# EAGLE design MASTER CEAQL PCB (EAGLE 9.2.0)
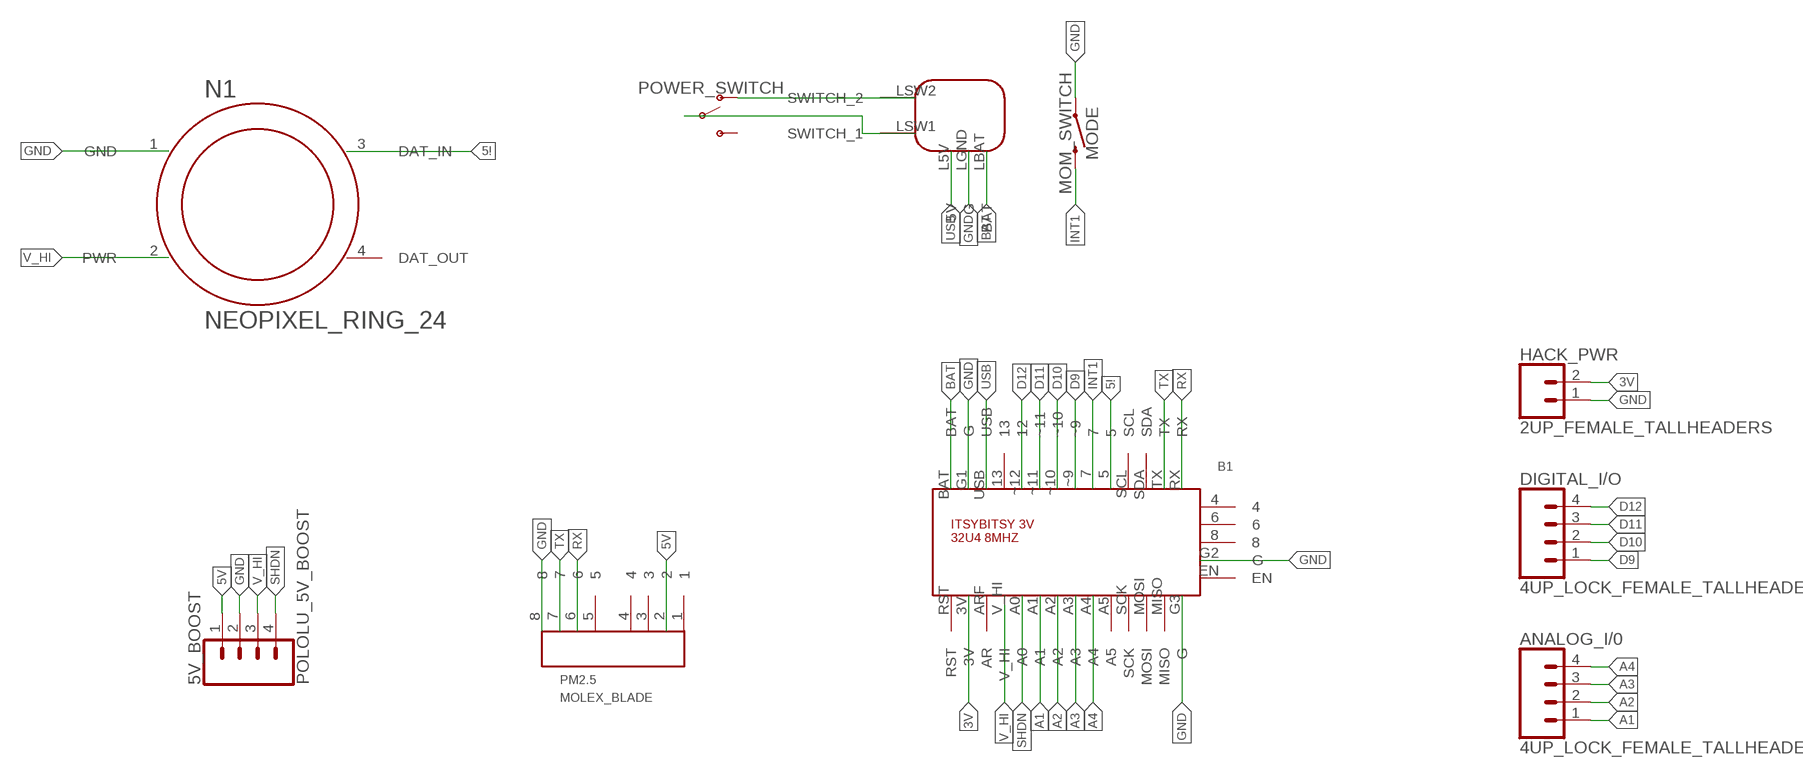
[diagram p0: schematic, sheet 1]

## Parts
5V_BOOST  POLOLU_5V_BOOST  [POLOLU_5V_HEADERS]
ANALOG_I/0  4UP_LOCK_FEMALE_TALLHEADERS  [1X04_LOCK_TALL]
B1  ITSY_BITSY  [ITSY_BITSY]
DIGITAL_I/O  4UP_LOCK_FEMALE_TALLHEADERS  [1X04_LOCK_TALL]
HACK_PWR  2UP_FEMALE_TALLHEADERS  [1X02]
L1  LIPOLY_CHARGER  [LIPOLY_CHARGER]
MODE  MOM_SWITCH  MOM_SWITCH_B3F-1000  [TACTILE_SWITCH_PTH_6.0MM]
N1  NEOPIXEL_RING_24  [NEOPIXEL_RNG_24]
PM2.5  MOLEX_BLADE  [53047-08]
POWER_SWITCH  SWITCH_SPDT_PINMOUNT  [SWITCH_SPDT_PTH_11.6X4.0MM_LOCK]

## Nets
3V: B1.3V HACK_PWR.2
5!: B1.5 N1.3(DAT_IN)
5V: 5V_BOOST.1 PM2.5.2
A1: ANALOG_I/0.1 B1.A1
A2: ANALOG_I/0.2 B1.A2
A3: ANALOG_I/0.3 B1.A3
A4: ANALOG_I/0.4 B1.A4
BAT: B1.BAT L1.LBAT(BAT)
D9: B1.~9 DIGITAL_I/O.1
D10: B1.~10 DIGITAL_I/O.2
D11: B1.~11 DIGITAL_I/O.3
D12: B1.~12 DIGITAL_I/O.4
GND: 5V_BOOST.2 B1.G1(G) B1.G2(G) B1.G3(G) HACK_PWR.1 L1.LGND(G) MODE.1 N1.1(GND) PM2.5.8
INT1: B1.7 MODE.2
N$5: L1.LSW2(SWITCH_2) POWER_SWITCH.1(O)
N$6: L1.LSW1(SWITCH_1) POWER_SWITCH.2(P)
RX: B1.RX PM2.5.6
SHDN: 5V_BOOST.4 B1.A0
TX: B1.TX PM2.5.7
USB: B1.USB L1.L5V(5V)
V_HI: 5V_BOOST.3 B1.V_HI N1.2(PWR)
Unconnected: B1.4 B1.6 B1.8 B1.13 B1.A5 B1.ARF(AR) B1.EN B1.MISO B1.MOSI B1.RST B1.SCK B1.SCL B1.SDA N1.4(DAT_OUT) PM2.5.1 PM2.5.3 PM2.5.4 PM2.5.5 POWER_SWITCH.3(S)

## Library data of the parts
5V_BOOST = TaylorSharpe Library:POLOLU_5V_BOOST: Pololu 5V Boost Board Low-profile headers (4-up) with board outline on footprint
ANALOG_I/0 DIGITAL_I/O = TaylorSharpe Library:4UP_LOCK_FEMALE_TALLHEADERS: 4-up locking connector to accommodate female header
B1 = TaylorSharpe Library:ITSY_BITSY: Adafruit ItsyBitsy 32u4 8MHz
HACK_PWR = TaylorSharpe Library:2UP_FEMALE_TALLHEADERS: 2-UP TALL FEMALE HEADERS 8.26mm black plastic headers
L1 = TaylorSharpe Library:LIPOLY_CHARGER
MODE = TaylorSharpe Library:MOM_SWITCH_B3F-1000: Adafruit Momentary Switch B3F-1000
N1 = TaylorSharpe Library:NEOPIXEL_RING_24: Neopixel Ring 24-Count Inverted - LEDs face down, away from board, on other side from through-holes
PM2.5 = TaylorSharpe Library:MOLEX_BLADE: Molex PicoBlade Header 1.25mm Pitch, 8-up
POWER_SWITCH = TaylorSharpe Library:SWITCH_SPDT_PINMOUNT: SPDT Switch Board-mounted, 2.54mm Pitch Mounted on the underside of the board, soldered on top

## Board
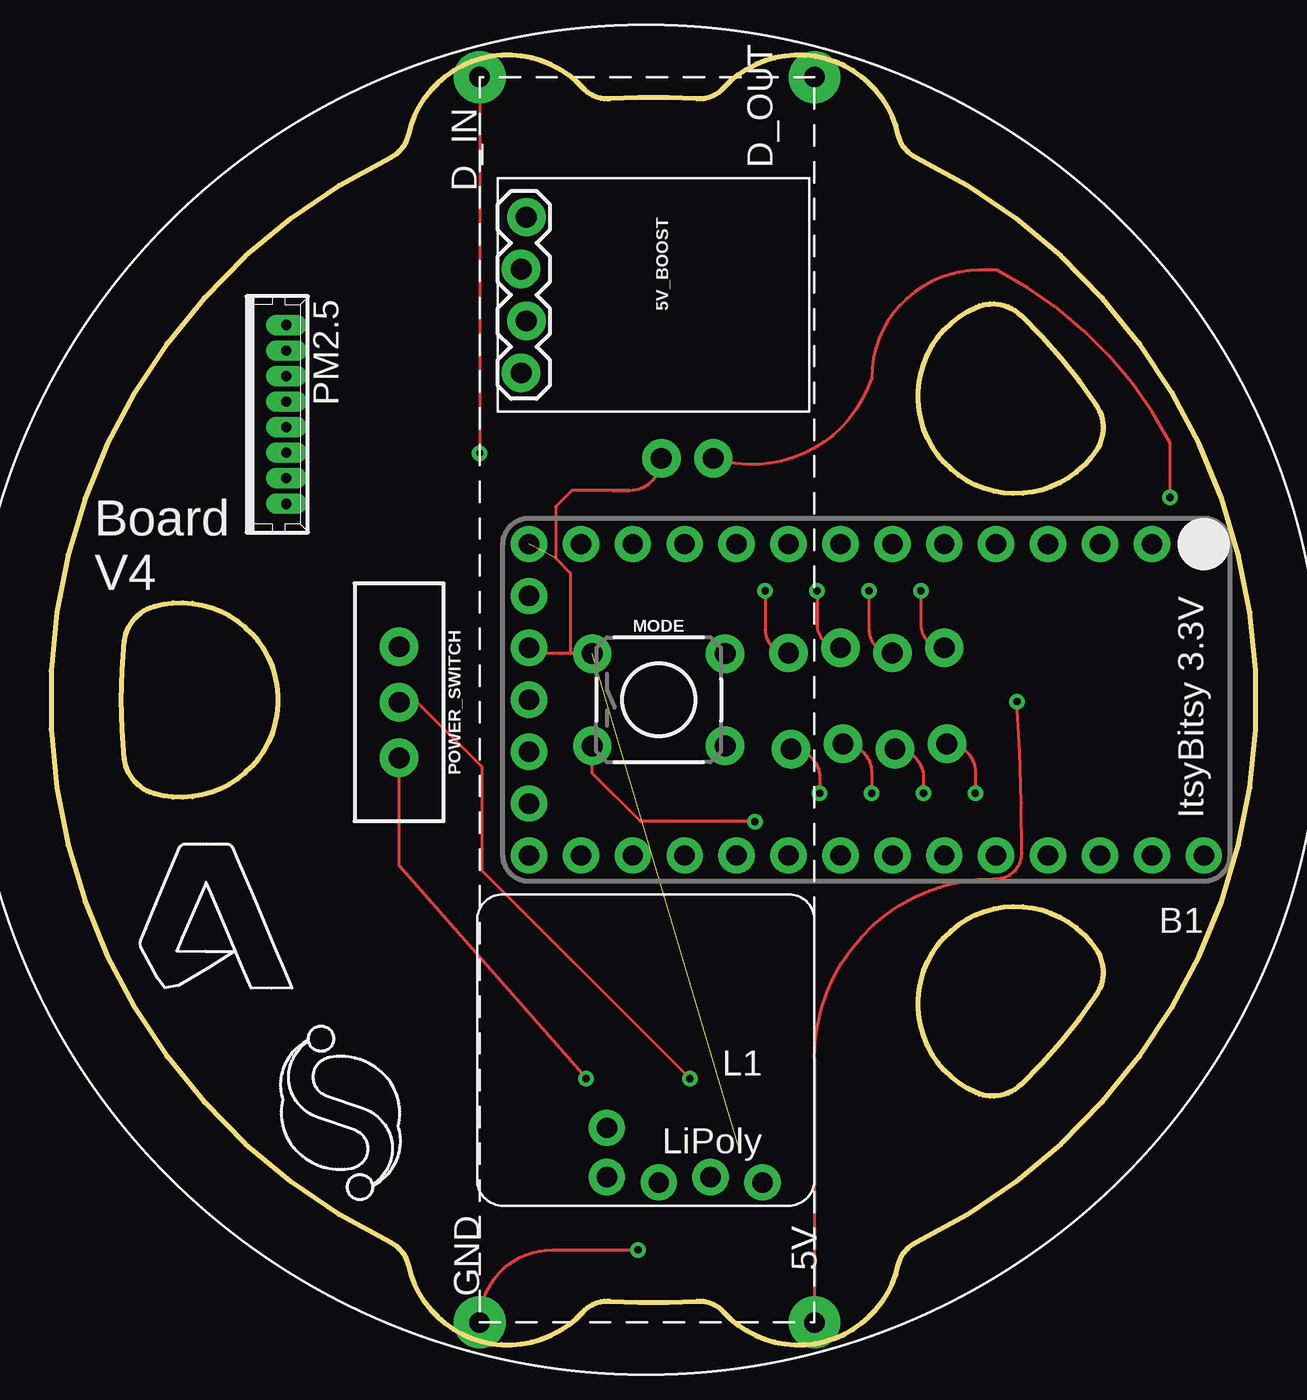
[diagram p1: board, top side]
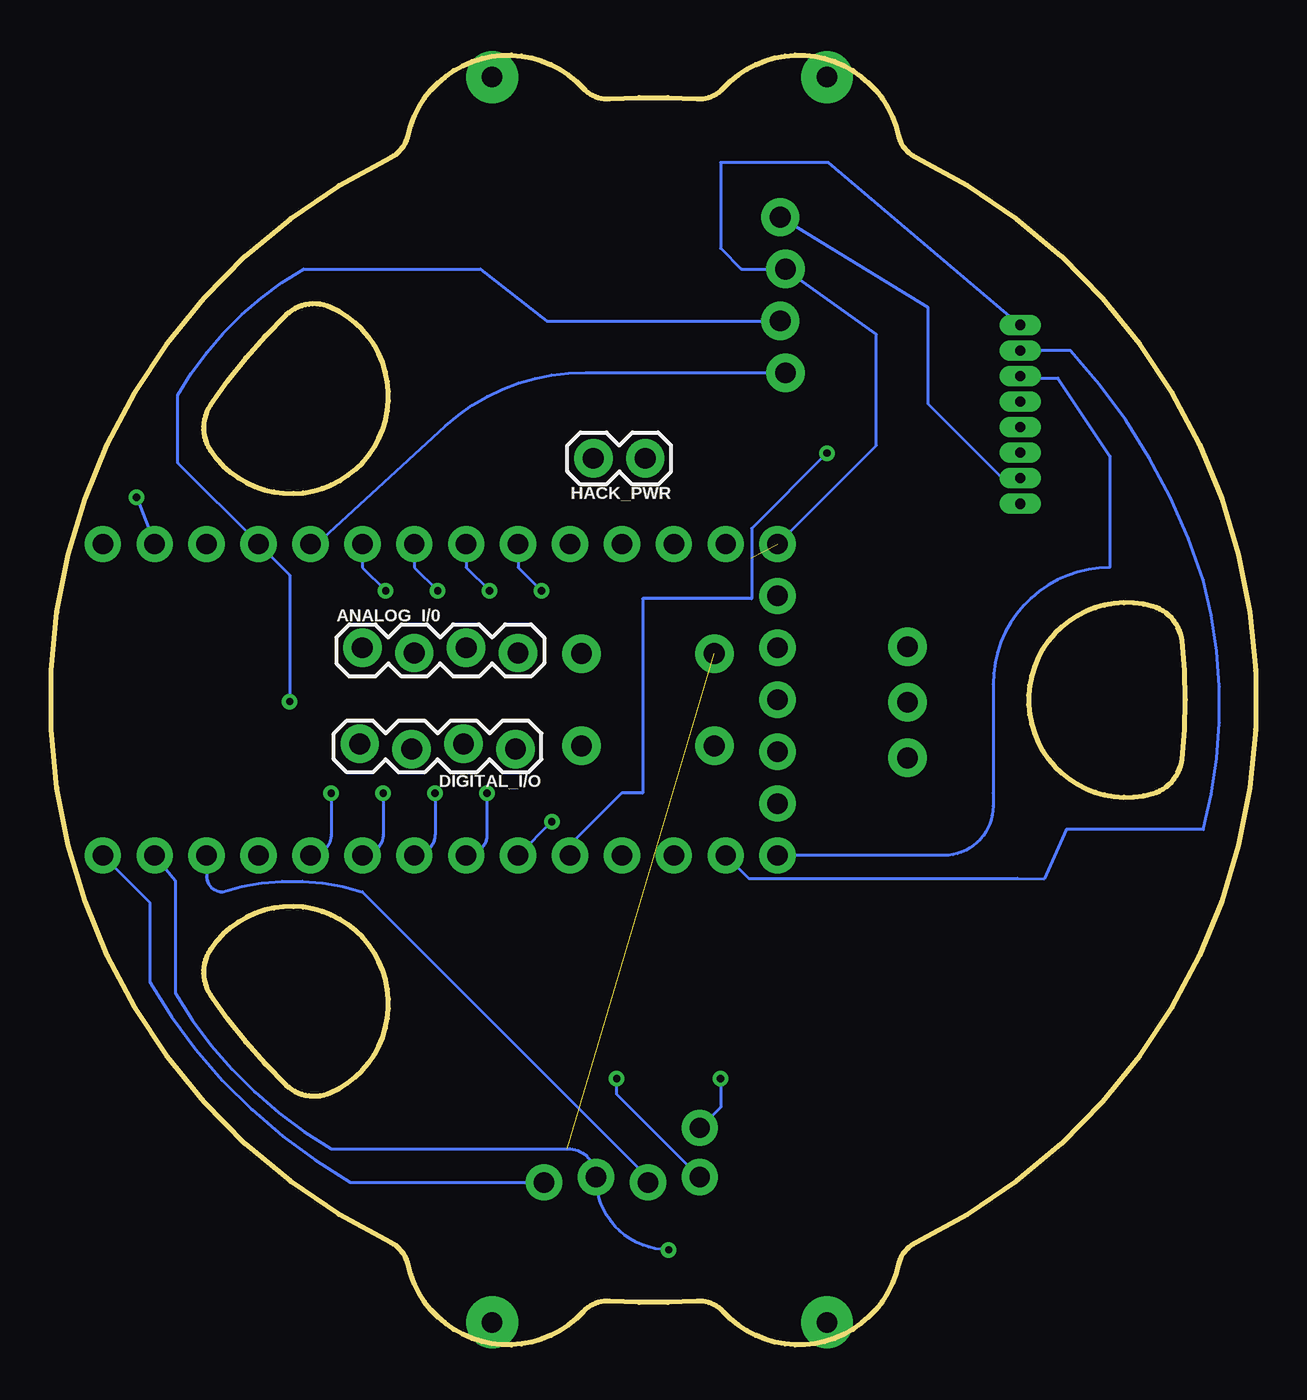
[diagram p2: board, bottom side, seen from below]

Size 58.93 x 63.12 mm. Coordinates in mm from the lower left corner, seen from the top.
Outline: 27.33,2.14 arc8 31.6,2.14 arc-52 32.89,1.62 arc125 41.46,3.92 arc-52 42.32,5.01 arc128 42.32,58.11 arc-52 41.46,59.2 arc125 32.89,61.5 arc-52 31.6,60.98 arc8 27.33,60.98 arc-52 26.04,61.5 arc125 17.47,59.2 arc-52 16.61,58.11 arc128 16.61,5.01 arc-52 17.47,3.92 arc125 26.04,1.62 arc-52 27.33,2.14
Outline: 51.13,19.36 arc-68 51.14,17.13 arc-13 47.44,12.72 arc-68 45.24,12.34 arc-212 51.13,19.36
Outline: 5.03,26.98 arc-68 3.59,28.68 arc-13 3.59,34.44 arc-68 5.03,36.14 arc-212 5.03,26.98
Outline: 45.24,50.78 arc-68 47.44,50.4 arc-13 51.14,45.99 arc-68 51.13,43.76 arc-212 45.24,50.78
Copper layers (1*16): Top 0.035mm / dielectric 1.5mm / Bottom 0.035mm
Design rules "default": minimum track width 6mil, minimum drill 0.35mm, track to track 6mil, track to pad 6mil, pad to pad 6mil, via to via 6mil, smd to smd 6mil, copper to edge 40mil, drill to drill 6mil, minimum pad ring 10mil, minimum via ring 8mil, stop-mask expansion 4mil, vias tented up to drill 0mil, thermal gap 10mil

### Footprints (pad centres in the part's own frame; a part is rotated, then mirrored left to right if it is on the bottom)
POLOLU_5V_HEADERS = drill 1.016 pad 1.88: 1 0,0.127; 2 2.54,-0.127; 3 5.08,0.127; 4 7.62,-0.127
1X04_LOCK_TALL = drill 1.016 pad 1.88: 1 0,0.127; 2 2.54,-0.127; 3 5.08,0.127; 4 7.62,-0.127
ITSY_BITSY = drill 1 pad 1.778: 3V 2.54,0; 4 33.02,12.7; 5 22.86,15.24; 6 33.02,10.16; 7 20.32,15.24; 8 33.02,7.62; 13 7.62,15.24; A0 10.16,0; A1 12.7,0; A2 15.24,0; A3 17.78,0; A4 20.32,0; A5 22.86,0; ARF 5.08,0; BAT 0,15.24; EN 33.02,2.54; G1 2.54,15.24; G2 33.02,5.08; G3 33.02,0; MISO 30.48,0; MOSI 27.94,0; RST 0,0; RX 33.02,15.24; SCK 25.4,0; SCL 25.4,15.24; SDA 27.94,15.24; TX 30.48,15.24; USB 5.08,15.24; V_HI 7.62,0; ~9 17.78,15.24; ~10 15.24,15.24; ~11 12.7,15.24; ~12 10.16,15.24
1X02 = drill 1.016 pad 1.88: 1 0,0; 2 2.54,0
LIPOLY_CHARGER = drill 1 pad 1.778: L5V 5.08,0.127; LBAT 0,0.127; LGND 2.54,-0.127; LSW1 7.62,-0.127; LSW2 7.62,-2.54
TACTILE_SWITCH_PTH_6.0MM = drill 1.016 pad 1.88: 1 -3.251,2.261; 2 -3.251,-2.261; 3 3.251,2.261; 4 3.251,-2.261
NEOPIXEL_RNG_24 = drill 1 pad 2.54: 1 0,0; 2 0,-16.383; 3 60.96,0; 4 60.96,-16.383
53047-08 = drill 0.5 pad 0.698 long: 1 4.375,0.45; 2 3.125,0.45; 3 1.875,0.45; 4 0.625,0.45; 5 -0.625,0.45; 6 -1.875,0.45; 7 -3.125,0.45; 8 -4.375,0.45
SWITCH_SPDT_PTH_11.6X4.0MM_LOCK = drill 1.016 pad 1.88: 1 0,2.718; 2 0,0; 3 0,-2.718

### Placement (x,y rotation side)
5V_BOOST  23.13,55.19 270 top
ANALOG_I/0  43.7,33.99 0 bottom
B1  56.4,39.19 180 top
DIGITAL_I/O  36.21,29.29 180 bottom
HACK_PWR  29.86,43.38 180 bottom
L1  34.81,8.08 180 top
MODE  29.73,31.57 0 top
N1  20.97,1.09 90 top
PM2.5  11.06,45.54 270 top
POWER_SWITCH  17.03,31.45 180 top

### Tracks (layer width: path | path; a pad name or v marks a point on that pad's centre or on a via)
3V  (via drill 0.35)
  Top 0.152: v54.75,41.48 54.75,44.15 arc35 46.31,52.59 45.42,52.59 arc90 40.15,47.32 arc-90 HACK_PWR.2
  Bottom 0.152: v54.75,41.48 B1.3V
5!  (via drill 0.35)
  Top 0.152: N1.3 v20.97,43.64
  Bottom 0.152: v20.97,43.64 24.65,39.95 24.65,36.53 29.99,36.53 29.99,27 31,27 33.54,24.46 | 33.54,24.59 33.54,24.46 | 33.54,24.46 B1.5
5V
  Bottom 0.152: PM2.5.2 12.38,42.42 16.02,46.05 16.02,50.77 5V_BOOST.1
A1  (via drill 0.35)
  Top 0.152: v42.56,36.91 42.56,35.26 arc90 ANALOG_I/0.1
  Bottom 0.152: B1.A1 43.7,38.05 v42.56,36.91
A2  (via drill 0.35)
  Top 0.152: v40.02,36.91 40.02,35 arc90 ANALOG_I/0.2
  Bottom 0.152: B1.A2 41.16,38.05 v40.02,36.91
A3  (via drill 0.35)
  Top 0.152: v37.48,36.91 37.48,35.26 arc90 ANALOG_I/0.3
  Bottom 0.152: B1.A3 38.62,38.05 v37.48,36.91
A4  (via drill 0.35)
  Top 0.152: v34.94,36.91 34.94,35 arc90 ANALOG_I/0.4
  Bottom 0.152: B1.A4 36.08,38.05 v34.94,36.91
BAT
  Bottom 0.152: L1.LBAT 44.29,7.95 arc30 54.1,17.76 54.1,21.65 B1.BAT
D9  (via drill 0.35)
  Top 0.152: DIGITAL_I/O.1 arc-90 37.61,27.76 v37.61,27
  Bottom 0.152: v37.61,27 37.61,24.97 arc90 B1.~9
D10  (via drill 0.35)
  Top 0.152: DIGITAL_I/O.2 arc-90 40.15,28.02 v40.15,27
  Bottom 0.152: v40.15,27 40.15,24.97 arc90 B1.~10
D11  (via drill 0.35)
  Top 0.152: DIGITAL_I/O.3 arc-90 42.69,27.76 v42.69,27
  Bottom 0.152: v42.69,27 42.69,24.97 arc90 B1.~11
D12  (via drill 0.35)
  Top 0.152: DIGITAL_I/O.4 arc-90 45.23,28.02 v45.23,27
  Bottom 0.152: v45.23,27 45.23,24.97 arc90 B1.~12
GND  (via drill 0.35)  (2 unrouted)
  Top 0.152: N1.1 arc-90 24.52,4.65 v28.72,4.65 | MODE.1 25.41,33.83 | B1.G2 23.66,33.83 24.91,33.83 25.41,33.83 | 28.3,41.82 27.45,41.82 | 27.45,41.82 25.49,41.82 24.69,41.03 24.69,38.5 25.41,37.78 25.41,33.83 | 27.45,41.82 28.3,41.82 | 28.3,41.82 arc90 HACK_PWR.1
  Bottom 0.152: B1.G3 18.56,44.02 18.56,49.46 5V_BOOST.2 25.16,52.65 26.18,53.67 26.18,57.86 20.88,57.86 PM2.5.8 | v28.72,4.65 arc90 L1.LGND arc-90 33.67,9.6 45.23,9.6 arc30 52.85,17.22 52.85,22.72 B1.G1
INT1  (via drill 0.35)
  Top 0.152: v34.43,25.6 28.84,25.6 26.48,27.97 MODE.2
  Bottom 0.152: v34.43,25.6 B1.7
N$5  (via drill 0.35)
  Top 0.152: POWER_SWITCH.1 17.03,23.44 v26.18,13.03
  Bottom 0.152: L1.LSW2 26.18,11.63 v26.18,13.03
N$6  (via drill 0.35)
  Top 0.152: POWER_SWITCH.2 17.92,31.45 21.1,28.27 21.1,23.19 v31.26,13.03
  Bottom 0.152: v31.26,13.03 31.26,12.27 L1.LSW1
RX
  Bottom 0.152: PM2.5.6 11.51,47.32 9.67,47.32 7.13,43.51 7.13,38.05 arc-90 12.84,32.33 12.84,27 12.84,26.37 arc90 15.25,23.95 B1.RX
SHDN
  Bottom 0.152: 5V_BOOST.4 32.78,47.57 arc-43 39.63,44.97 45.94,39.19 B1.A0
TX
  Bottom 0.152: B1.TX 24.8,22.83 11.66,22.83 10.35,22.81 9.27,25.22 2.55,25.22 arc-30 2.55,37.43 arc-25 9.06,48.67 PM2.5.7
USB
  Bottom 0.152: L1.L5V 29.73,8.2 43.7,22.17 arc-35 50.56,22.17 arc90 51.32,22.94 B1.USB
V_HI  (via drill 0.35)
  Top 0.152: N1.2 37.35,14.05 arc-90 46.11,22.81 46.24,22.81 arc90 47.5,24.06 arc4 v47.26,31.48
  Bottom 0.152: 5V_BOOST.3 34.69,50.11 37.93,52.65 46.58,52.65 arc-30 52.74,46.49 52.73,43.16 48.78,39.21 B1.V_HI | B1.V_HI 48.78,39.34 | B1.V_HI 47.26,37.67 v47.26,31.48

### Text on the board
tPlace: Board / V4